# EAGLE schematic electronic_schematic (EAGLE 9.5.2)
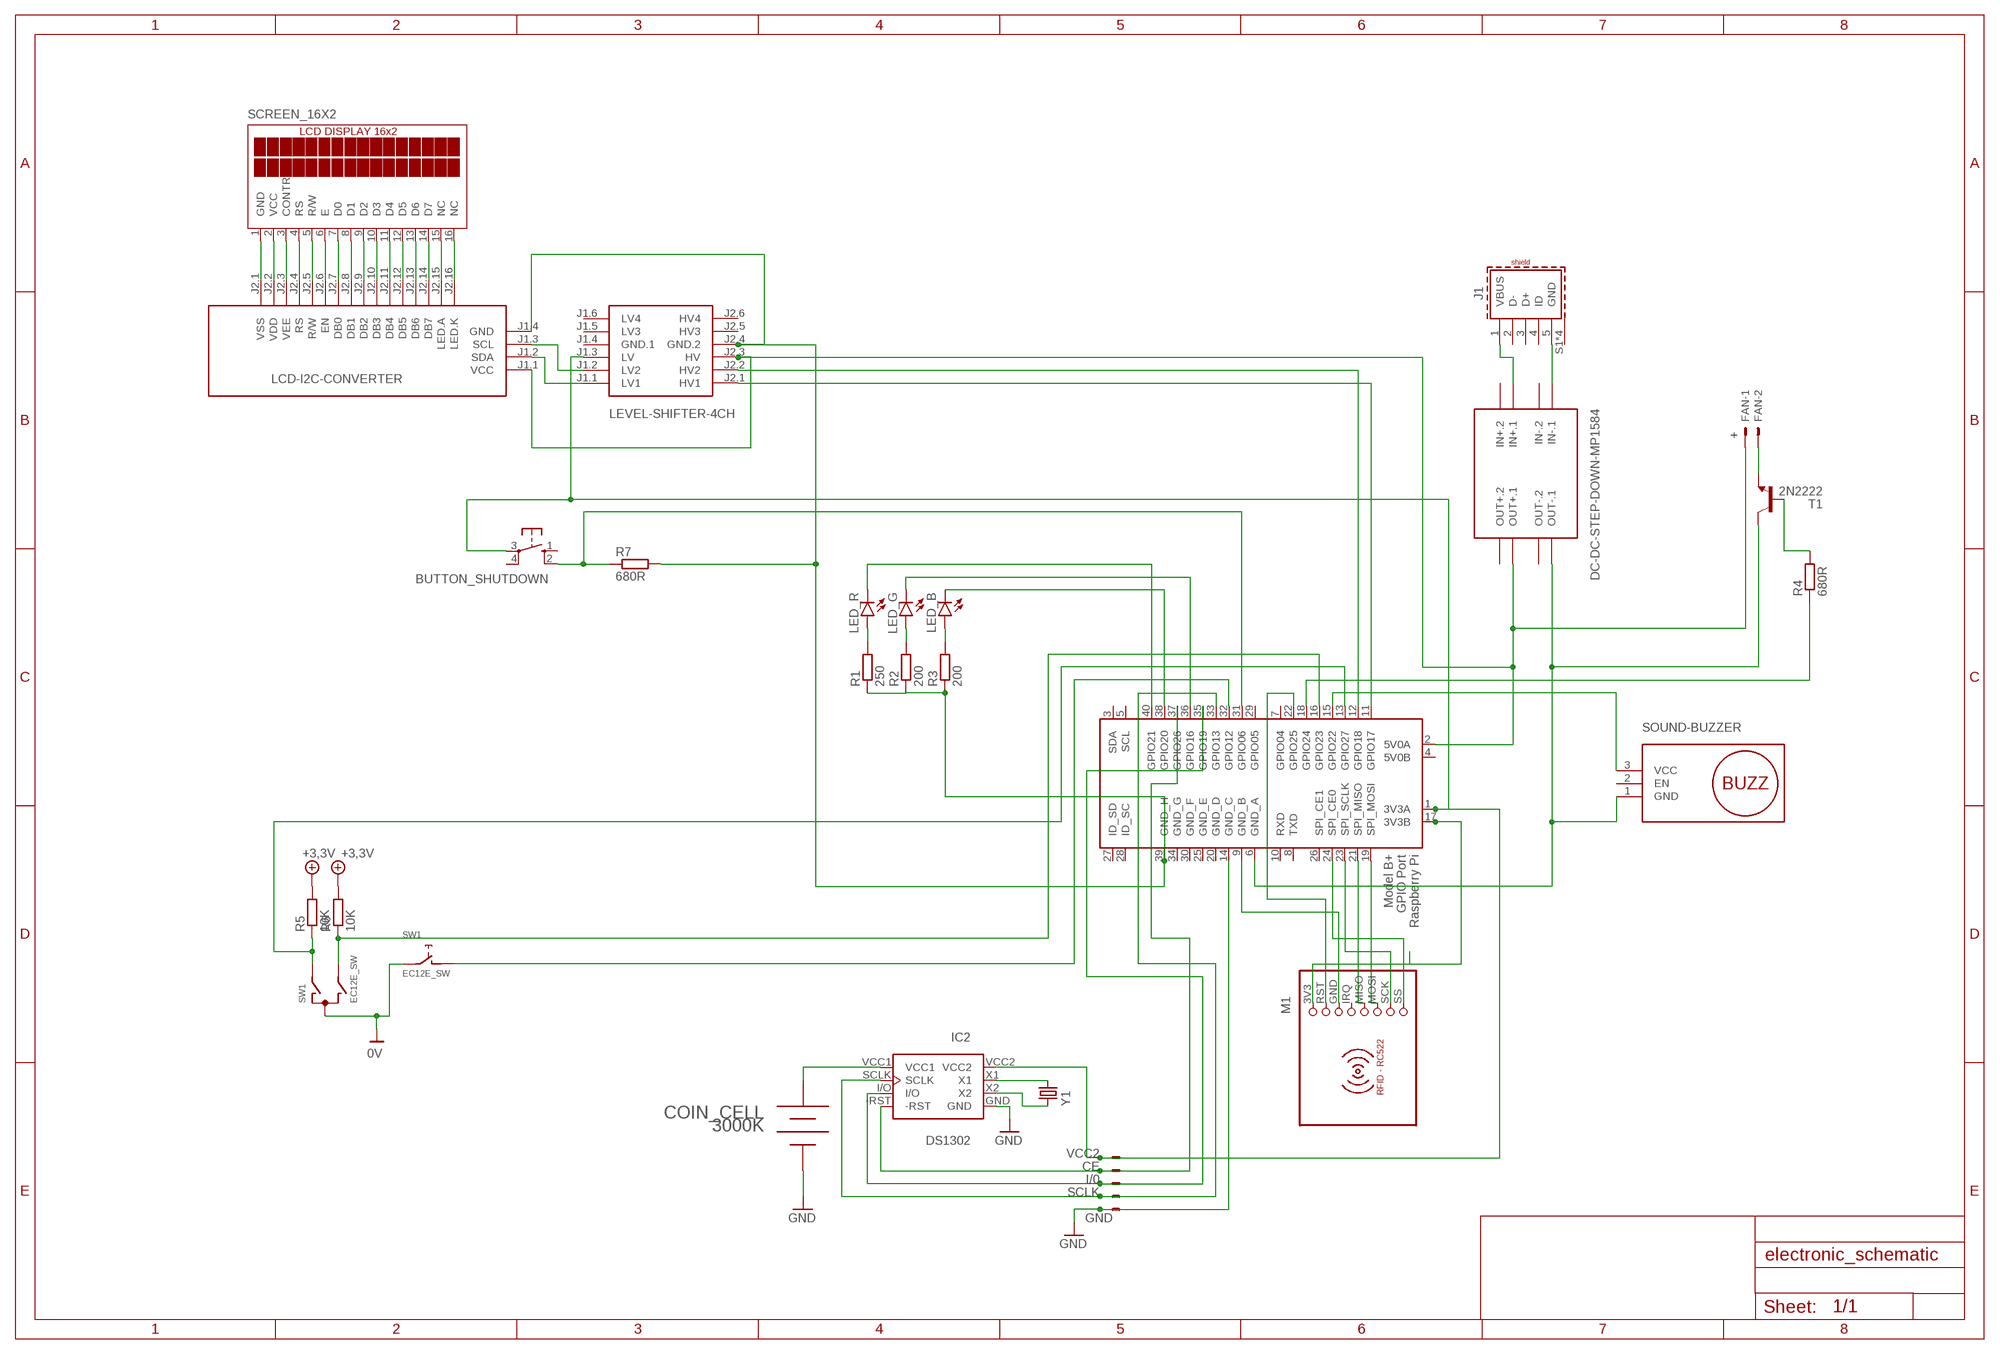
[diagram p0: schematic, sheet 1]

## Parts
BUTTON_SHUTDOWN  10-XX  [B3F-10XX]
COIN_CELL  3000K  [3000K]
FAN  +  22-23-2021  [22-23-2021]
IC2  DS1302  [DIL08]
J1  629105136821  [629105136821]
LED_B  LED3MM  [LED3MM]
LED_G  LED3MM  [LED3MM]
LED_R  LED3MM  [LED3MM]
M1  RFID-RC522  [RFID-RC522]
R1  250  R-EU_0207/10  [0207/10]
R2  200  R-EU_0207/10  [0207/10]
R3  200  R-EU_0207/10  [0207/10]
R4  680R  R-EU_0207/10  [0207/10]
R5  10K  R-EU_0207/10  [0207/10]
R6  10K  R-EU_0207/10  [0207/10]
R7  680R  R-EU_0207/10  [0207/10]
RTC  22-23-2051  [22-23-2051]
SCREEN_16X2  TUXGR_16X2_R2  [TUXGR_16X2_R2]
SW1  EC12E_SW  [ALPS_EC12E_SW]
T1  2N2222  [TO18]
U$1  LCD-I2C-CONVERTER  [LCD-I2C-CONVERTER]
U$2  LEVEL-SHIFTER-4CH  [LEVEL-SHIFTER-4CH]
U$4  SOUND-BUZZER  [SOUND-BUZZER]
U$5  DC-DC-STEP-DOWN-MP1584  [DC-DC-STEP-DOWN-MP1584]
X1  RASPI_GPIO_B+#_BOX  [RASPI_GPIO_B+_BOX]
Y1  CC1V  [CC1V]

## Nets
5+: FAN.1 U$1.J1.1(VCC) U$2.J2.3(HV) U$5.OUT+.1 X1.2(5V0A)
+5V: R5.2 R6.2 ; supply symbol labelled +3,3V
-: COIN_CELL.- ; supply symbol labelled GND
CE: IC2.-RST RTC.4 X1.37(GPIO26)
GND: IC2.GND RTC.1 SW1.C SW1.E X1.14(GND_C) ; supply symbol labelled 0V
I/0: IC2.I/O RTC.3 X1.35(GPIO19)
N$1: LED_R.A R1.2
N$2: LED_G.A R2.2
N$3: LED_B.A R3.2
N$4: J1.5(GND) U$5.IN-.1
N$5: J1.1(VBUS) U$5.IN+.1
N$6: M1.SS X1.24(SPI_CE0)
N$7: T1.3(C) U$4.1(GND) U$5.OUT-.1 X1.6(GND_A)
N$8: U$2.J2.1(HV1) X1.11(GPIO17)
N$9: LED_R.K(C) X1.40(GPIO21)
N$10: LED_G.K(C) X1.36(GPIO16)
N$11: LED_B.K(C) X1.38(GPIO20)
N$12: SCREEN_16X2.1(GND) U$1.J2.1(VSS)
N$13: SCREEN_16X2.2(VCC) U$1.J2.2(VDD)
N$14: SCREEN_16X2.3(CONTR) U$1.J2.3(VEE)
N$15: SCREEN_16X2.4(RS) U$1.J2.4(RS)
N$16: SCREEN_16X2.5(R/W) U$1.J2.5(R/W)
N$17: SCREEN_16X2.6(E) U$1.J2.6(EN)
N$18: SCREEN_16X2.7(D0) U$1.J2.7(DB0)
N$19: SCREEN_16X2.8(D1) U$1.J2.8(DB1)
N$20: SCREEN_16X2.9(D2) U$1.J2.9(DB2)
N$21: SCREEN_16X2.10(D3) U$1.J2.10(DB3)
N$22: SCREEN_16X2.11(D4) U$1.J2.11(DB4)
N$23: SCREEN_16X2.12(D5) U$1.J2.12(DB5)
N$24: SCREEN_16X2.13(D6) U$1.J2.13(DB6)
N$25: SCREEN_16X2.14(D7) U$1.J2.14(DB7)
N$26: SCREEN_16X2.15(NC) U$1.J2.15(LED.A)
N$27: SCREEN_16X2.16(NC) U$1.J2.16(LED.K)
N$28: R1.1 R2.1 R3.1 R7.2 U$1.J1.4(GND) U$2.J2.4(GND.2) X1.39(GND_H)
N$29: BUTTON_SHUTDOWN.2(S1) R7.1 X1.31(GPIO06)
N$30: U$1.J1.2(SDA) U$2.J1.1(LV1)
N$31: U$1.J1.3(SCL) U$2.J1.2(LV2)
N$32: U$2.J2.2(HV2) X1.12(GPIO18)
N$33: R5.1 SW1.A X1.13(GPIO27)
N$34: R6.1 SW1.B X1.16(GPIO23)
N$35: SW1.D X1.32(GPIO12)
N$36: U$4.3(VCC) X1.15(GPIO22)
N$37: M1.MISO X1.21(SPI_MISO)
N$38: M1.MOSI X1.19(SPI_MOSI)
N$39: M1.SCK X1.23(SPI_SCLK)
N$40: M1.3V3 X1.17(3V3B)
N$42: M1.RST X1.22(GPIO25)
N$43: M1.GND X1.9(GND_B)
N$44: FAN.2 T1.1(E)
N$45: R4.2 T1.2(B)
N$46: R4.1 X1.18(GPIO24)
N$47: IC2.X1 Y1.'2'
N$48: IC2.X2 Y1.'1'
SCLK: IC2.SCLK RTC.2 X1.33(GPIO13)
VCC1: COIN_CELL.+ IC2.VCC1
VCC2: BUTTON_SHUTDOWN.3(P) IC2.VCC2 RTC.5 U$2.J1.3(LV) X1.1(3V3A)
Unconnected: BUTTON_SHUTDOWN.1(S) BUTTON_SHUTDOWN.4(P1) J1.2(D-) J1.3(D+) J1.4(ID) J1.S1(SHIELD) J1.S2(SHIELD) J1.S3(SHIELD) J1.S4(SHIELD) M1.IRQ SW1.GND1(G) SW1.GND2(G) U$2.J1.5(LV3) U$2.J1.6(LV4) U$2.J2.5(HV3) U$2.J2.6(HV4) U$4.2(EN) U$5.IN+.2 U$5.IN-.2 U$5.OUT+.2 U$5.OUT-.2 X1.3(SDA) X1.5(SCL) X1.7(GPIO04) X1.8(TXD) X1.10(RXD) X1.26(SPI_CE1) X1.27(ID_SD) X1.28(ID_SC) X1.29(GPIO05)

## Power pins joined to a net without a drawn wire
5V0B: X1.4(5V0B)
GND.1: U$2.J1.4(GND.1)
GND_D: X1.20(GND_D)
GND_E: X1.25(GND_E)
GND_F: X1.30(GND_F)
GND_G: X1.34(GND_G)

## Library data of the parts
BUTTON_SHUTDOWN = switch-omron:10-XX: OMRON SWITCH; MPN: B3F-1000; OC_FARNELL: 176432; OC_NEWARK: 36M3542
COIN_CELL = b_keystone_3000k_sm_battery:3000K: SMT Battery Holder from Keystone for 12mm coin cells BR1216, CR1216, BR1220, CL1220, CR1220, BR1225
FAN = con-molex:22-23-2021: .100" (2.54mm) Center Header - 2 Pin; MF: MOLEX; MPN: 22-23-2021; OC_FARNELL: 1462926; OC_NEWARK: 25C3832
IC2 = ds1302:DS1302: Real-time clock (RTC) counts seconds, minutes hours, date of the month, month, day of the week, and year with leap-year compensation valid up to 2100
J1 = Wurth_Connectors_WR-USB:629105136821: WR-COM Micro USB 2.0 SMT Type B Horizontal 5 Contacts Kind Properties Durability:10 000 Mating cycles Quality Class:10 000 Mating cycles Connector Type:Micro USB Gender:Receptacle Type:Horizontal General Information Operating Temperature:-40up to +105 °C Compliance:RoHS Electrical Properties IR 1:1A Working Voltage:30V (AC) Withstanding Voltage:100V (AC) Contact Resistance:30 mΩ Material Properties Insulator Material:LCP Insulator Flammability Rating:UL94 V-0 Color:Black Contact Material:Copper Alloy Contact Plating: Gold Contact Type:Stamped Shielding Material:Stainless Steel Shielding Plating:Nickel <https://www.we-online.com/catalog/media/o32999v209%20Family_WR-COM_629105136821.jpg> Details see: https://www.we-online.com/catalog/en/COM_MICRO_SMT_TYPE_B_HORIZONTAL/ Updated by Yingchun, Shan 2020-01-16 2020 (C) Würth Elektronik; APPLICATION: Micro USB 2.0; DATASHEET-URL: https://www.we-online.com/catalog/datasheet/629105136821.pdf; GERDER: Receptacle; INTERFACE-TYPE: Type B; IR1: 1.0A; MOUNT: SMT; PACKAGING: Tape and Reel; PART-NUMBER: 629105136821; PINS: 5; TYPE: Horizontal; WORKING-VOLTAGE: 30V(AC)
LED_B LED_G LED_R = led:LED: LED OSRAM: - CHIPLED LG R971, LG N971, LY N971, LG Q971, LY Q971, LO R971, LY R971 LH N974, LH R974 LS Q976, LO Q976, LY Q976 LO Q996 - Hyper CHIPLED LW Q18S LB Q993, LB Q99A, LB R99A - SideLED LS A670, LO A670, LY A670, LG A670, LP A670 LB A673, LV A673, LT A673, LW A673 LH A674 LY A675 LS A676, LA A676, LO A676, LY A676, LW A676 LS A679, LY A679, LG A679 - Hyper Micro SIDELED® LS Y876, LA Y876, LO Y876, LY Y876 LT Y87S - SmartLED LW L88C, LW L88S LB L89C, LB L89S, LG L890 LS L89K, LO L89K, LY L89K LS L896, LA L896, LO L896, LY L896 - TOPLED LS T670, LO T670, LY T670, LG T670, LP T670 LSG T670, LSP T670, LSY T670, LOP T670, LYG T670 LG T671, LOG T671, LSG T671 LB T673, LV T673, LT T673, LW T673 LH T674 LS T676, LA T676, LO T676, LY T676, LB T676, LH T676, LSB T676, LW T676 LB T67C, LV T67C, LT T67C, LS T67K, LO T67K, LY T67K, LW E67C LS E67B, LA E67B, LO E67B, LY E67B, LB E67C, LV E67C, LT E67C LW T67C LS T679, LY T679, LG T679 LS T770, LO T770, LY T770, LG T770, LP T770 LB T773, LV T773, LT T773, LW T773 LH T774 LS E675, LA E675, LY E675, LS T675 LS T776, LA T776, LO T776, LY T776, LB T776 LHGB T686 LT T68C, LB T68C - Hyper Mini TOPLED® LB M676 - Mini TOPLED Santana® LG M470 LS M47K, LO M47K, LY M47K Source: http://www.osram.convergy.de LUXEON: - LUMILED® LXK2-PW12-R00, LXK2-PW12-S00, LXK2-PW14-U00, LXK2-PW14-V00 LXK2-PM12-R00, LXK2-PM12-S00, LXK2-PM14-U00 LXK2-PE12-Q00, LXK2-PE12-R00, LXK2-PE12-S00, LXK2-PE14-T00, LXK2-PE14-U00 LXK2-PB12-K00, LXK2-PB12-L00, LXK2-PB12-M00, LXK2-PB14-N00, LXK2-PB14-P00, LXK2-PB14-Q00 LXK2-PR12-L00, LXK2-PR12-M00, LXK2-PR14-Q00, LXK2-PR14-R00 LXK2-PD12-Q00, LXK2-PD12-R00, LXK2-PD12-S00 LXK2-PH12-R00, LXK2-PH12-S00 LXK2-PL12-P00, LXK2-PL12-Q00, LXK2-PL12-R00 Source: www.luxeon.com KINGBRIGHT: KA-3528ASYC Source: www.kingbright.com
M1 = mfrc522-module:RFID-RC522: RFID-RC522 MFRC-522 based breakout board
R1-R7 = rcl:R-EU_: RESISTOR, European symbol; SPICEPREFIX: R
RTC = con-molex:22-23-2051: .100" (2.54mm) Center Header - 5 Pin; MF: MOLEX; MPN: 22-23-2051; OC_FARNELL: 1462952; OC_NEWARK: 38C9178
SCREEN_16X2 = display-lcd:TUXGR_16X2_R2: Tuxgraphics LCD display 16x2 characters reflective, without background light Source: tuxgr_12x2_r2.pdf; OC_FARNELL: unknown; OC_NEWARK: unknown
SW1 = switch-alps:EC12E_SW: ALPS rotary Encoder EC12E series with switch; MPN: EC12E2424407; OC_FARNELL: 1520813; OC_NEWARK: 74M1068
T1 = transistor:2N2222: NPN TRANSISTOR
U$1 = diy-modules:LCD-I2C-CONVERTER: I2C Bus to 4-Bit Parallel LCD Interface with LED backlight driver
U$2 = diy-modules:LEVEL-SHIFTER-4CH: 4-Channel Bi-Directional Logic Level Converter based on BSS128 transistors Click here to find device on ebay.com <http://www.ebay.com/sch/i2c+logic+converter+module>
U$4 = diy-modules:SOUND-BUZZER: Sound Buzzer Module Click here to find device on ebay.com <http://www.ebay.com/sch/passive+buzzer+beep+module>
U$5 = diy-modules:DC-DC-STEP-DOWN-MP1584: DC/DC Step-Down Regulator based on MP1584 chip MP1584 datasheet available here: http://www.haoyuelectronics.com/Attachment/MP1584/MP1584.pdf Click here to find device on ebay.com <http://www.ebay.com/sch/mp1584+module>
X1 = raspberrypi_bastelstube_v13:RASPI_GPIO_B+#: 2x20 header connector, all pins connected
Y1 = golledge_full_v1-0:CC1V: Crystal |SM| 8.0 x 3.7 mm | Frequency Range 10kHz - 2.1 MHz High shock & vibration resistance Military temperature range -55+125°C option Miniature ceramic package Low frequency range, 10kHz to 2.10MHz Datasheet <http://www.golledge.com/docs/products/xtl_sm/cc1vt.htm?src=eagle>; HEIGHT: 1.75